# Altium schematic sheet Recorder.SchDoc: Shepherd - Recorder
size A3; Author: Kai; CompanyName: NES Lab / TU Dresden; DrawnBy: Ingmar; DocumentNumber: 4; SheetNumber: 4; SheetTotal: 8
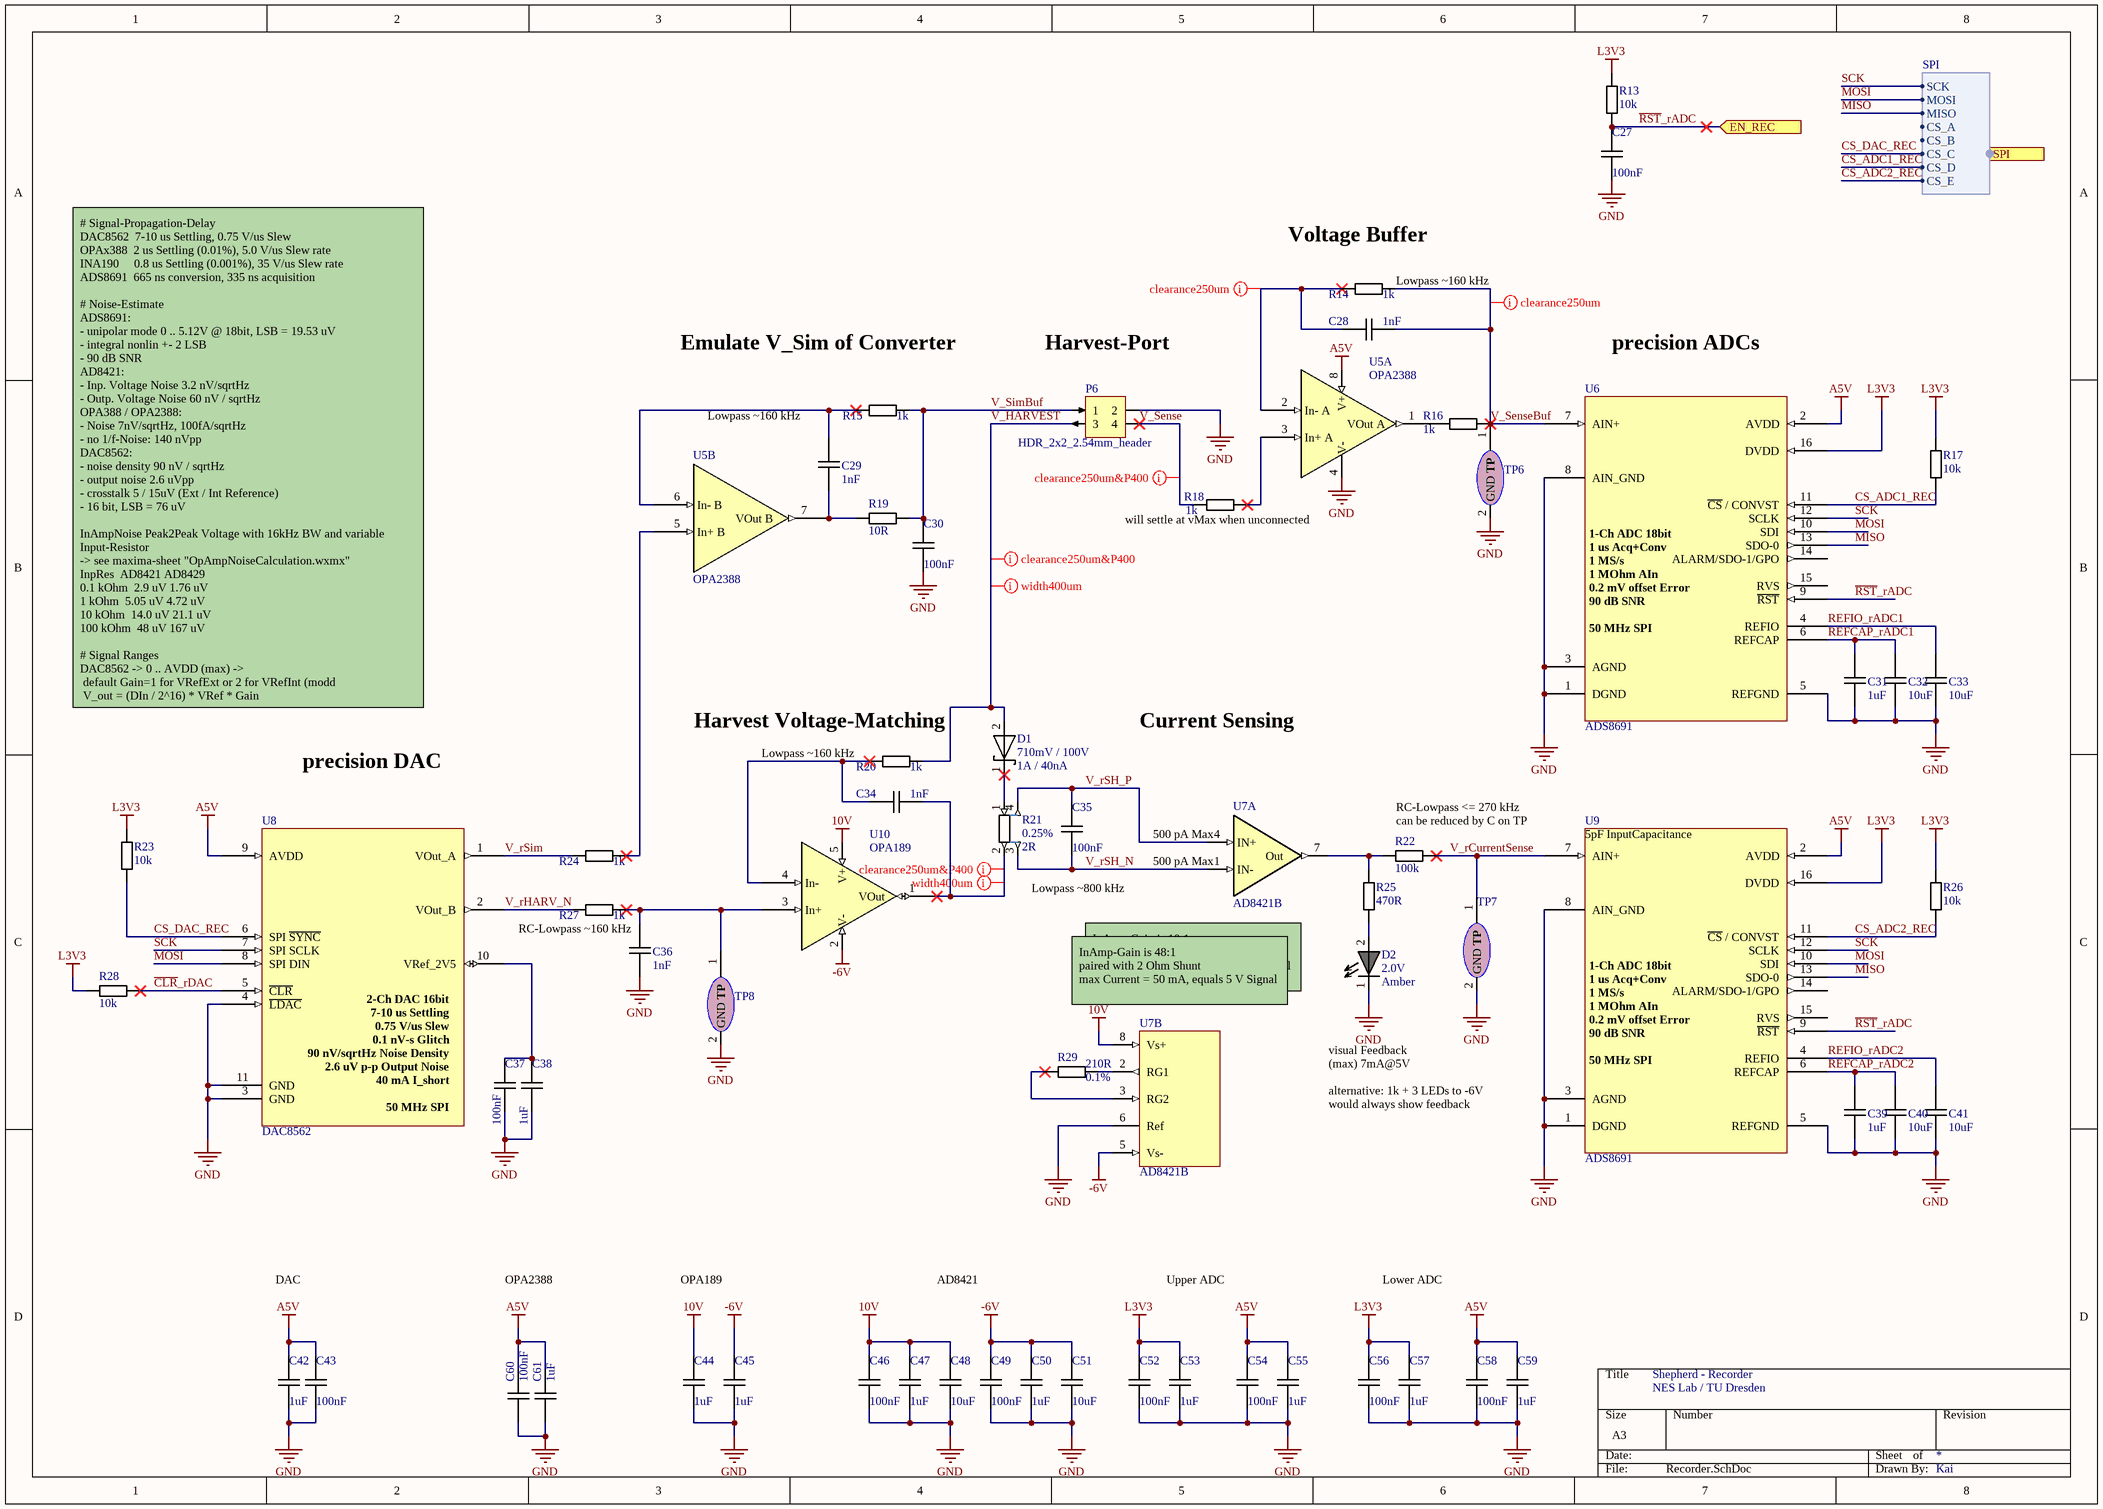
[diagram p0: Recorder.SchDoc]

## Parts
C27  value 100nF  [CAPC1005X06]  (hidden comment: C_0402_100nF_16V)
C28  value 1nF  [CAPC1005X06]  (hidden comment: C_0402_1nF_50V)
C29  value 1nF  [CAPC1005X06]  (hidden comment: C_0402_1nF_50V)
C30  value 100nF  [CAPC1005X06]  (hidden comment: C_0402_100nF_16V)
C31  value 1uF  [CAPC1005X06]  (hidden comment: C_0402_1uF_25V)
C32  value 10uF  [CAPC1608X09]  (hidden comment: C_0603_10uF_16V)
C33  value 10uF  [CAPC1608X09]  (hidden comment: C_0603_10uF_16V)
C34  value 1nF  [CAPC1005X06]  (hidden comment: C_0402_1nF_50V)
C35  value 100nF  [CAPC1005X06]  (hidden comment: C_0402_100nF_16V)
C36  value 1nF  [CAPC1005X06]  (hidden comment: C_0402_1nF_50V)
C37  value 100nF  [CAPC1005X06]  (hidden comment: C_0402_100nF_16V)
C38  value 1uF  [CAPC1005X06]  (hidden comment: C_0402_1uF_25V)
C39  value 1uF  [CAPC1005X06]  (hidden comment: C_0402_1uF_25V)
C40  value 10uF  [CAPC1608X09]  (hidden comment: C_0603_10uF_16V)
C41  value 10uF  [CAPC1608X09]  (hidden comment: C_0603_10uF_16V)
C42  value 1uF  [CAPC1005X06]  (hidden comment: C_0402_1uF_25V)
C43  value 100nF  [CAPC1005X06]  (hidden comment: C_0402_100nF_16V)
C44  value 1uF  [CAPC1005X06]  (hidden comment: C_0402_1uF_25V)
C45  value 1uF  [CAPC1005X06]  (hidden comment: C_0402_1uF_25V)
C46  value 100nF  [CAPC1005X06]  (hidden comment: C_0402_100nF_16V)
C47  value 1uF  [CAPC1005X06]  (hidden comment: C_0402_1uF_25V)
C48  value 10uF  [CAPC1608X09]  (hidden comment: C_0603_10uF_16V)
C49  value 100nF  [CAPC1005X06]  (hidden comment: C_0402_100nF_16V)
C50  value 1uF  [CAPC1005X06]  (hidden comment: C_0402_1uF_25V)
C51  value 10uF  [CAPC1608X09]  (hidden comment: C_0603_10uF_16V)
C52  value 100nF  [CAPC1005X06]  (hidden comment: C_0402_100nF_16V)
C53  value 1uF  [CAPC1005X06]  (hidden comment: C_0402_1uF_25V)
C54  value 100nF  [CAPC1005X06]  (hidden comment: C_0402_100nF_16V)
C55  value 1uF  [CAPC1005X06]  (hidden comment: C_0402_1uF_25V)
C56  value 100nF  [CAPC1005X06]  (hidden comment: C_0402_100nF_16V)
C57  value 1uF  [CAPC1005X06]  (hidden comment: C_0402_1uF_25V)
C58  value 100nF  [CAPC1005X06]  (hidden comment: C_0402_100nF_16V)
C59  value 1uF  [CAPC1005X06]  (hidden comment: C_0402_1uF_25V)
C60  value 100nF  [CAPC1005X06]  (hidden comment: C_0402_100nF_16V)
C61  value 1uF  [CAPC1005X06]  (hidden comment: C_0402_1uF_25V)
D1  value 710mV / 100V  I_max: 1A / 40nA  [SODFL350X110-2N]  (hidden comment: D_SOD123W_710mV_1A)
D2  value Amber  V_max: 2.0V  [DIOM1608X02N Orange]  (hidden comment: D_LED_0603_Amber)
P6  HDR_2x2_2.54mm_header  [P_Pinheader_2x2_R2.54mm]
R13  value 10k  [RESC1005X04]  (hidden comment: R_0402_10k)
R14  value 1k  [RESC1005X04]  (hidden comment: R_0402_1k)
R15  value 1k  [RESC1005X04]  (hidden comment: R_0402_1k)
R16  value 1k  [RESC1005X04]  (hidden comment: R_0402_1k)
R17  value 10k  [RESC1005X04]  (hidden comment: R_0402_10k)
R18  value 1k  [RESC1005X04]  (hidden comment: R_0402_1k)
R19  value 10R  [RESC1005X04]  (hidden comment: R_0402_10R)
R20  value 1k  [RESC1005X04]  (hidden comment: R_0402_1k)
R21  value 2R  Tolerance: 0.25%  [RESC3116X06 Shunt]  (hidden comment: R_1206_2R_0.25%)
R22  value 100k  [RESC1005X04]  (hidden comment: R_0402_100k_1%)
R23  value 10k  [RESC1005X04]  (hidden comment: R_0402_10k)
R24  value 1k  [RESC1005X04]  (hidden comment: R_0402_1k)
R25  value 470R  [RESC1005X04]  (hidden comment: R_0402_470R)
R26  value 10k  [RESC1005X04]  (hidden comment: R_0402_10k)
R27  value 1k  [RESC1005X04]  (hidden comment: R_0402_1k)
R28  value 10k  [RESC1005X04]  (hidden comment: R_0402_10k)
R29  value 210R  Tolerance: 0.1%  [RESC1005X04]  (hidden comment: R_0402_210R_0.1%)
TP6  Testpoint  [P_Testpins_Precision]  (value not drawn)  (no BOM)
TP7  Testpoint  [P_Testpins_Precision]  (value not drawn)  (no BOM)
TP8  Testpoint  [P_Testpins_Precision]  (value not drawn)  (no BOM)
U5  OPA2388  [TSOP65P490X110-8N]  (parts A,B of 2)
U6  ADS8691  [TSOP65P640X120-16N]
U7  AD8421B  [TSOP65P490X110-8N]  (parts A,B of 2)
U8  DAC8562  [PSON50P300X80_HS-11N]
U9  ADS8691  [TSOP65P640X120-16N]
U10  OPA189  [SOT95P280X145-5N]

## Ports
EN_REC (in), SPI (in, harness SPI)

## Harnesses
SPI: SCK, MOSI, MISO, CS_A, CS_B, CS_C, CS_D, CS_E

## Nets
10V: C44.2 C46.2 C47.2 C48.2 U7.8(Vs+) U10.5(V+)
-6V: C45.2 C49.2 C50.2 C51.2 U7.5(Vs-) U10.2(V-)
A5V: C42.2 C43.2 C54.2 C55.2 C58.2 C59.2 C60.2 C61.2 U5.8(V+) U6.2(AVDD) U8.9(AVDD) U9.2(AVDD)
GND: C27.1 C30.2 C31.1 C32.1 C33.1 C36.1 C37.1 C38.1 C39.1 C40.1 C41.1 C42.1 C43.1 C44.1 C45.1 C46.1 C47.1 C48.1 C49.1 C50.1 C51.1 C52.1 C53.1 C54.1 C55.1 C56.1 C57.1 C58.1 C59.1 C60.1 C61.1 D2.1 P6.2 TP6.2(GND) TP7.2(GND) TP8.2(GND) U5.4(V-) U6.1(DGND) U6.3(AGND) U6.5(REFGND) U6.8(AIN_GND) U7.6(Ref) U8.3(GND) U8.4(~{LDAC}) U8.11(GND) U9.1(DGND) U9.3(AGND) U9.5(REFGND) U9.8(AIN_GND)
L3V3: C52.2 C53.2 C56.2 C57.2 R13.1 R17.2 R23.2 R26.2 R28.2 U6.16(DVDD) U9.16(DVDD)
~{CLR}_rDAC: R28.1 U8.5(~{CLR})
CS_ADC1_REC: R17.1 U6.11(~{CS}_/_CONVST) ; port SPI.CS_D
CS_ADC2_REC: R26.1 U9.11(~{CS}_/_CONVST) ; port SPI.CS_E
CS_DAC_REC: R23.1 U8.6(SPI_~{SYNC}) ; port SPI.CS_C
MISO: U6.13(SDO-0) U9.13(SDO-0) ; port SPI.MISO
MOSI: U6.10(SDI) U8.8(SPI_DIN) U9.10(SDI) ; port SPI.MOSI
~{RST}_rADC: C27.2 R13.2 U6.9(~{RST}) U9.9(~{RST}) ; port EN_REC
REFCAP_rADC1: C31.2 C32.2 U6.6(REFCAP)
REFCAP_rADC2: C39.2 C40.2 U9.6(REFCAP)
REFIO_rADC1: C33.2 U6.4(REFIO)
REFIO_rADC2: C41.2 U9.4(REFIO)
SCK: U6.12(SCLK) U8.7(SPI_SCLK) U9.12(SCLK) ; port SPI.SCK
V_HARVEST: D1.2 P6.3 R20.2
V_rCurrentSense: R22.2 TP7.1(TP) U9.7(AIN+)
V_rHARV_N: R27.1 U8.2(VOut_B)
V_rSH_N: C35.1 R21.3 U7.1(IN-)
V_rSH_P: C35.2 R21.4 U7.4(IN+)
V_rSim: R24.1 U8.1(VOut_A)
V_Sense: P6.4 R18.1
V_SenseBuf: C28.2 R14.2 R16.2 TP6.1(TP) U6.7(AIN+)
V_SimBuf: C30.1 P6.1 R15.2 R19.2
NetC28_1: C28.1 R14.1 U5.2(In-_A)
NetC29_1: C29.1 R19.1 U5.7(VOut_B)
NetC29_2: C29.2 R15.1 U5.6(In-_B)
NetC34_1: C34.1 R21.2 U10.1(VOut)
NetC34_2: C34.2 R20.1 U10.4(In-)
NetC36_2: C36.2 R27.2 TP8.1(TP) U10.3(In+)
NetC37_2: C37.2 C38.2 U8.10(VRef_2V5)
NetD1_1: D1.1 R21.1
NetD2_2: D2.2 R25.1
NetR16_1: R16.1 U5.1(VOut_A)
NetR18_2: R18.2 U5.3(In+_A)
NetR22_1: R22.1 R25.2 U7.7(Out)
NetR24_2: R24.2 U5.5(In+_B)
NetR29_1: R29.1 U7.3(RG2)
NetR29_2: R29.2 U7.2(RG1)

Not connected (* = marked no-connect by the designer): U6 14(ALARM/SDO-1/GPO) 15(RVS); U9 14(ALARM/SDO-1/GPO) 15(RVS)

## Layout directives
rule Width Constraint [Pref Width = 0.4mm    Min Width = 0.4mm    Max Width = 1mm]: NetC34_1, V_HARVEST
rule Clearance Constraint [Clearance = 0.25mm]: NetC28_1, V_SenseBuf
rule Clearance Constraint [Generic clearance = 0.25mm, and 7 value(s) for objects]: V_HARVEST, V_Sense
rule Clearance Constraint [Generic clearance = 0.25mm, and 17 value(s) for objects]: NetC34_1

## Notes on the sheet
- (near R14) Voltage Buffer
- (near R14) Lowpass ~160 kHz
- Emulate V_Sim of Converter
- Harvest-Port
- precision ADCs
- Lowpass ~160 kHz
- (near R18) will settle at vMax when unconnected
- # Signal-Propagation-Delay
  DAC8562  7-10 us Settling, 0.75 V/us Slew
  OPAx388  2 us Settling (0.01%), 5.0 V/us Slew rate
  INA190     0.8 us Settling (0.001%), 35 V/us Slew rate
  ADS8691  665 ns conversion, 335 ns acquisition
  # Noise-Estimate
  ADS8691:
  - unipolar mode 0 .. 5.12V @ 18bit, LSB = 19.53 uV
  - integral nonlin +- 2 LSB
  - 90 dB SNR
  AD8421:
  - Inp. Voltage Noise 3.2 nV/sqrtHz
  - Outp. Voltage Noise 60 nV / sqrtHz
  OPA388 / OPA2388:
  - Noise 7nV/sqrtHz, 100fA/sqrtHz
  - no 1/f-Noise: 140 nVpp
  DAC8562:
  - noise density 90 nV / sqrtHz
  - output noise 2.6 uVpp
  - crosstalk 5 / 15uV (Ext / Int Reference)
  - 16 bit, LSB = 76 uV
  InAmpNoise Peak2Peak Voltage with 16kHz BW and variable Input-Resistor
  -> see maxima-sheet "OpAmpNoiseCalculation.wxmx"
  InpRes		AD8421	AD8429
  0.1 kOhm		2.9 uV	1.76 uV
  1 kOhm		5.05 uV	4.72 uV
  10 kOhm		14.0 uV	21.1 uV
  100 kOhm		48 uV	167 uV
  # Signal Ranges
  DAC8562 -> 0 .. AVDD (max) ->
  default Gain=1 for VRefExt or 2 for VRefInt (modd
  V_out = (DIn / 2^16) * VRef * Gain
  OPA388
- precision DAC
- (near R20) Harvest Voltage-Matching
- (near R20) Lowpass ~160 kHz
- Current Sensing
- (near U7) 500 pA Max
- (near R22) RC-Lowpass <= 270 kHz
- (near R22) can be reduced by C on TP
- (near U9) 5pF InputCapacitance
- Lowpass ~800 kHz
- RC-Lowpass ~160 kHz
- InAmp-Gain is 10:1
  paired with 10 Ohm Shunt
  max Current = 50 mA, equals 5 V Signal
- (near U7) InAmp-Gain is 48:1
  paired with 2 Ohm Shunt
  max Current = 50 mA, equals 5 V Signal
- visual Feedback
- (max) 7mA@5V
- alternative: 1k + 3 LEDs to -6V
- would always show feedback
- DAC
- OPA2388
- OPA189
- AD8421
- Upper ADC
- Lower ADC
- (in symbol ADS8691) 1-Ch ADC 18bit / 1 us Acq+Conv / 1 MS/s / 1 MOhm AIn / 0.2 mV offset Error / 90 dB SNR / 50 MHz SPI /
- (in symbol DAC8562-DSC) 2-Ch DAC 16bit / 7-10 us Settling / 0.75 V/us Slew / 0.1 nV-s Glitch / 90 nV/sqrtHz Noise Density / 2.6 uV p-p Output Noise / 40 mA I_short / 50 MHz SPI

## Library data of the parts
C27 C30 C35 C37 C43 C46 C49 C52 C54 C56 C58 C60 = .C_0402_100nF_16V: Capacitor; Manufacturer: Taiyo Yuden; Manufacturer PN: EMF105B7104MVHF; V_max: 16V; Tolerance: 20%; Dielectric: X7R; Distributer: Mouser; Distributer PN: 963-EMF105B7104MVHF; Price n10 [€]: 0.03
C28 C29 C34 C36 = .C_0402_1nF_50V: Capacitor; Manufacturer: Murata; Manufacturer PN: GRM1555C1H102JA01D; V_max: 50V; Tolerance: 5%; Dielectric: C0G; Distributer: Mouser; Distributer PN: 81-GRM1555C1H102JA1D; Price n10 [€]: 0.02
C31 C38 C39 C42 C44 C45 C47 C50 C53 C55 C57 C59 C61 = .C_0402_1uF_25V: Capacitor; Manufacturer: Murata; Manufacturer PN: GRM155R61E105KA12J; V_max: 25V; Tolerance: 10%; Dielectric: X5R; Distributer: Mouser; Distributer PN: 81-GRM155R61E105KA2J; Price n10 [€]: 0.06
C32 C33 C40 C41 C48 C51 = .C_0603_10uF_16V: Capacitor; Manufacturer: Taiyo Yuden; Manufacturer PN: EMK107BBJ106MA-T; V_max: 16V; Tolerance: 20%; Dielectric: X5R; Distributer: Mouser; Distributer PN: 963-EMK107BBJ106MA-T; Price n10 [€]: 0.14
D1 = .D_SOD123W_710mV_1A: Diode Si, 710mV 1A forward, 100V 40nA reverse, 50A Surge,; Manufacturer: Nexperia; Manufacturer PN: PMEG10010ELRX; Distributer: Mouser; Distributer PN: 771-PMEG10010ELRX; Price n10 [€]: 0.24
D2 = .D_LED_0603_Amber: LED Amber 610nm, 0603, 130 mcd, 2V@20mA; Manufacturer: Wuerth; Manufacturer PN: 150060AS75000; I_max: 20mA; I_typ: 5mA; V_typ: 1.9V; Distributer: Mouser; Distributer PN: 710-150060AS75000; Price n10 [€]: 0.12
P6 = .P_HDR_2x2_2.54mm_male: Gold, Straight, 5.80 mm Mating, 3.46 mm termination; Manufacturer: Amphenol; Manufacturer PN: 861400042YO2319LF; I_max: 3A; V_max: 1kV; Distributer: Mouser; Distributer PN: 649-86140042YO2319LF; Price n10 [€]: 0.12
R13 R17 R23 R26 R28 = .R_0402_10k: Resistor; Manufacturer: Panasonic; Manufacturer PN: ERJ-2GEJ103X; P_max: 100mW; V_max: 50V; Tolerance: 5%; Distributer: Mouser; Distributer PN: 667-ERJ-2GEJ103X; Price n10 [€]: 0.02
R14-R16 R18 R20 R24 R27 = .R_0402_1k: Resistor; Manufacturer: Panasonic; Manufacturer PN: ERJ-2GEJ102X; P_max: 100mW; V_max: 50V; Tolerance: 5%; Distributer: Mouser; Distributer PN: 667-ERJ-2GEJ102X; Price n10 [€]: 0.02
R19 = .R_0402_10R: Resistor; Manufacturer: Panasonic; Manufacturer PN: ERJ-2GEJ100X; P_max: 100mW; V_max: 50V; Tolerance: 5%; Distributer: Mouser; Distributer PN: 667-ERJ-2GEJ100X; Price n10 [€]: 0.02
R21 = .R_1206_2R_0.25%: Resistor 25 ppm/C; Manufacturer: Yageo; Manufacturer PN: RT1206CRD072RL; P_max: 250mW; V_max: 200V; Distributer: Mouser; Distributer PN: 603-RT1206CRD072RL; Price n10 [€]: 0.35
R22 = .R_0402_100k: Resistor; Manufacturer: Panasonic; Manufacturer PN: ERJ-2RKF1003X; P_max: 100mW; V_max: 50V; Tolerance: 1%; Distributer: Mouser; Distributer PN: 667-ERJ-2RKF1003X; Price n10 [€]: 0.02
R25 = .R_0402_470R: Resistor; Manufacturer: Panasonic; Manufacturer PN: ERJ-2GEJ471X; P_max: 100mW; V_max: 50V; Tolerance: 5%; Distributer: Mouser; Distributer PN: 667-ERJ-2GEJ471X; Price n10 [€]: 0.02
R29 = .R_0402_210R_0.1%: Resistor 25ppm/C; Manufacturer: Yageo; Manufacturer PN: RT0402BRD07210RL; P_max: 62mW; V_max: 50V; Distributer: Mouser; Distributer PN: 603-RT0402BRD07210RL; Price n10 [€]: 0.19
TP6-TP8 = Testpoint_Precision
U5 = OPA2388: OpAmp High Precision, 30-60 mA perm, 5 V/us Slew, 7 nV/sqrtHz NoiseDist, 0.25 uV Offset, Z_id 100 MOhm, Z_ic 60 TOhm; Manufacturer: TI; Manufacturer PN: OPA2388IDGKR; V_max: 5.5V; V_min: 2.5V; Distributer: Mouser; Distributer PN: 595-OPA2388IDGKR; Price n10 [€]: 2.63
U6 U9 = ADS8691: ADC, 1CH, 18 Bit, 1 MS/s, 50 MHz SPI, 335 ns Acq & 665 ns Conv; Manufacturer: TI; Manufacturer PN: ADS8691IPWR; V_max: 5.25V; V_min: 1.65V; Distributer: Mouser; Distributer PN: 595-ADS8691IPWR; Price n10 [€]: 8.5
U7 = AD8421B: Low Noise InAmp, / 134 dB CMRR @ G100, f60Hz / 0.1 % Gain Error / 10 ppm Gain NonLin / 65mA max Output; Manufacturer: Analog; Manufacturer PN: AD8421BRMZ; I_max: 2.3mA; V_max: 18V; V_min: 2.5V; Distributer: Mouser; Distributer PN: 584-AD8421BRMZ; Price n10 [€]: 8.10
U8 = DAC8562-DSC: DAC, 2 CH, 10 us Settling, 16 bit Res, 50 MHz SPI; Manufacturer: TI; Manufacturer PN: DAC8562SDSCR; V_max: 5.5V; V_min: 2.7V; Distributer: Mouser; Distributer PN: 595-DAC8562SDSCR; Price n10 [€]: 6.73
U10 = OPA189-DBV: OpAmp High Precision, +-65 mA perm, 20 V/us Slew, 5 nV/sqrtHz NoiseDist, Z_id 100 MOhm, Z_ic 60 TOhm, Iq ~ 1.7 mA; Manufacturer: TI; Manufacturer PN: OPA189IDBVR; V_max: 36V; V_min: 4.5V; Distributer: Mouser; Distributer PN: 595-OPA189IDBVR; Price n10 [€]: 2.02